# EAGLE design PS TPS54340 Voltage CurrentRev2_1 (EAGLE 9.2.2)
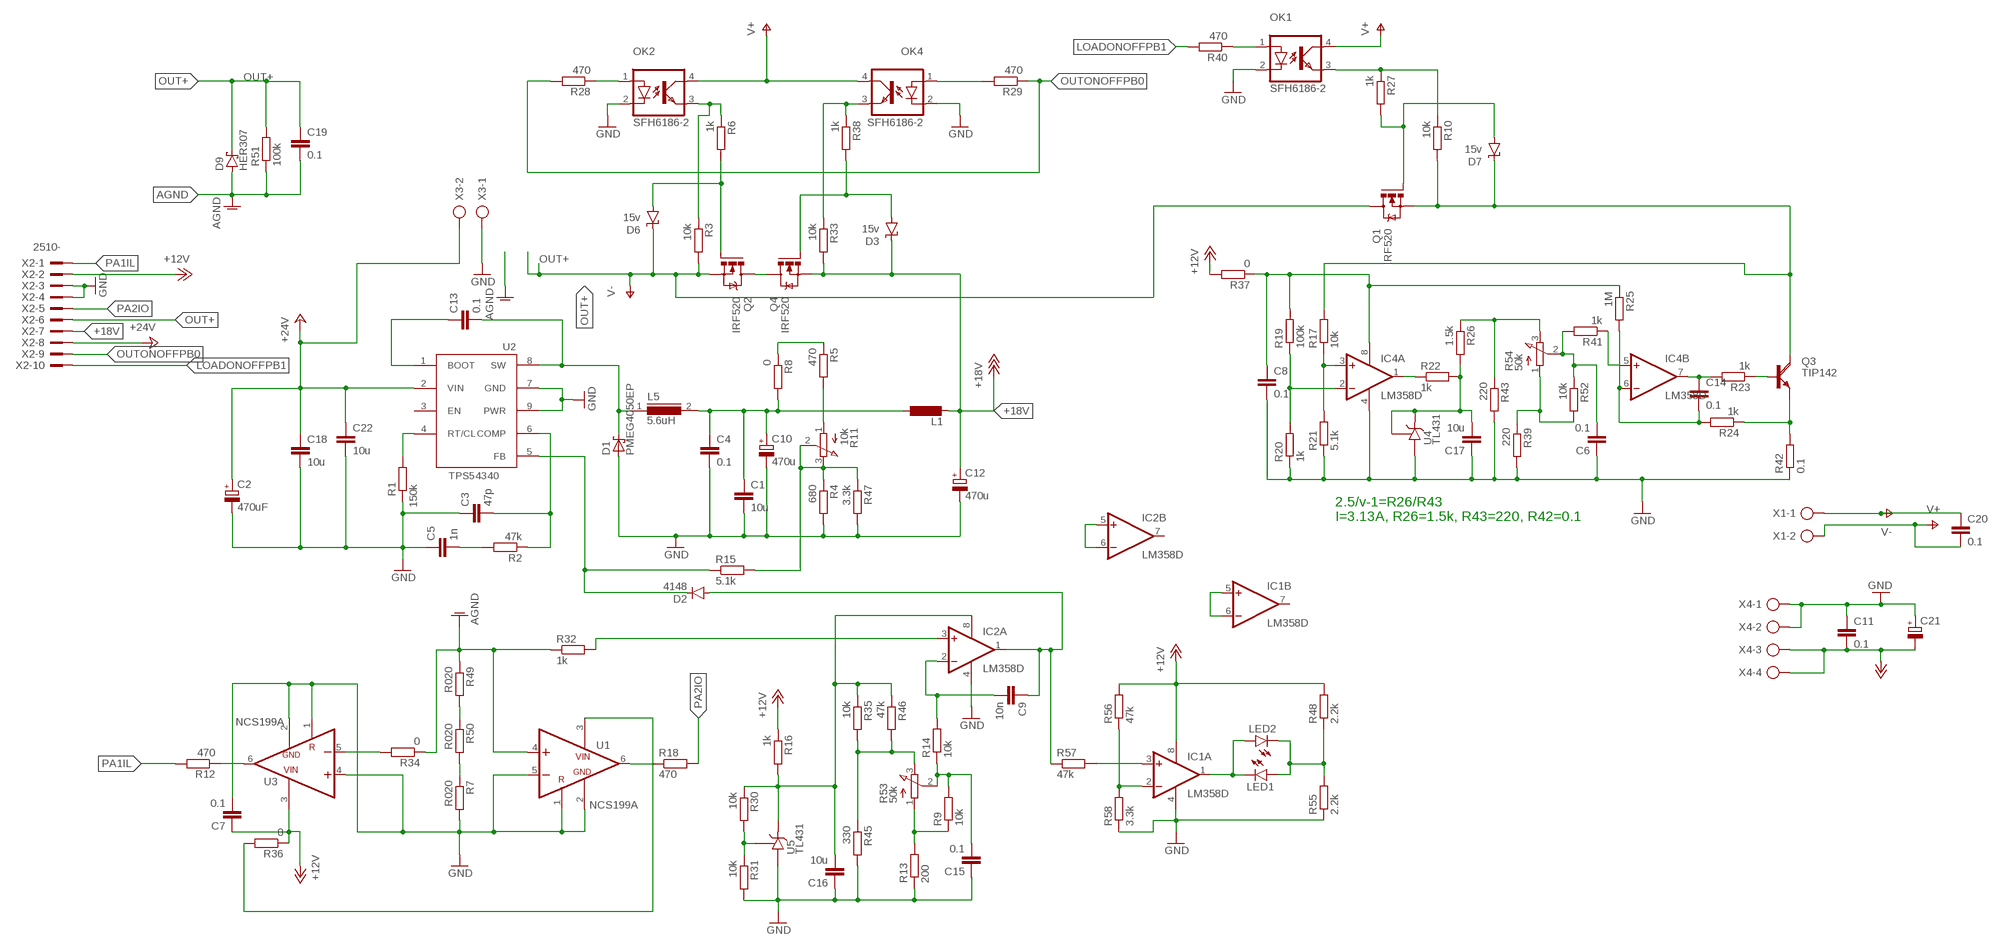
[diagram p0: schematic, sheet 1]

## Parts
C1  10u  C-EUC1210  [C1210]
C2  470uF  CPOL-EUE5-10.5  [E5-10,5]
C3  47p  C-EUC0603K  [C0603K]
C4  0.1  C-EUC1206  [C1206]
C5  1n  C-EUC0603K  [C0603K]
C6  0.1  C-EUC0603K  [C0603K]
C7  0.1  C-EUC0603K  [C0603K]
C8  0.1  C-EUC1206  [C1206]
C9  10n  C-EUC0603K  [C0603K]
C10  470u  CPOL-EUE5-10.5  [E5-10,5]
C11  0.1  C-EUC1206  [C1206]
C12  470u  CPOL-EUE5-10.5  [E5-10,5]
C13  0.1  C-EU102-043X133  [C102-043X133]
C14  0.1  C-EUC1206  [C1206]
C15  0.1  C-EUC0603K  [C0603K]
C16  10u  C-EUC0603K  [C0603K]
C17  10u  C-EUC0603K  [C0603K]
C18  10u  C-EUC1210  [C1210]
C19  0.1  C-EU150-054X183  [C150-054X183]
C20  0.1  C-EUC1206  [C1206]
C21  CPOL-EUE2.5-6  [E2,5-6]
C22  10u  C-EUC1210  [C1210]
D1  PMEG4050EP  [SOD128]
D2  4148  PMLL41SOD80C  [SOD80C]
D3  15v  SUPPRESSOR-SMBJ  [SMBJ]
D6  15v  SUPPRESSOR-SMBJ  [SMBJ]
D7  15v  SUPPRESSOR-SMBJ  [SMBJ]
D9  HER307  15KEXX  [CB429-17]
IC1  LM358D  [SO08]
IC2  LM358D  [SO08]
IC4  LM358D  [SO08]
L1  L-EU0207/5V  [0207/5V]
L5  5.6uH  DR125  [DR125]
LED1  LEDB152  [Q62902-B152]
LED2  LEDB152  [Q62902-B152]
OK1  SFH6186-2  [SMD4-7]
OK2  SFH6186-2  [SMD4-7]
OK4  SFH6186-2  [SMD4-7]
Q1  IRF520  [TO220BV]
Q2  IRF520  [TO220BV]
Q3  TIP142  [SOT93]
Q4  IRF520  [TO220BV]
R1  150k  R-EU_R1206  [R1206]
R2  47k  R-EU_R0603  [R0603]
R3  10k  R-EU_R0603  [R0603]
R4  680  R-EU_R1206  [R1206]
R5  470  R-EU_R1206  [R1206]
R6  1k  R-EU_R0603  [R0603]
R7  R020  R-EU_R1206  [R1206]
R8  0  R-EU_R0603  [R0603]
R9  10k  R-EU_R0603  [R0603]
R10  10k  R-EU_R0603  [R0603]
R11  10k  3RP/1610N  [3RP/1610N]
R12  470  R-EU_R0603  [R0603]
R13  200  R-EU_R0603  [R0603]
R14  10k  R-EU_R1206  [R1206]
R15  5.1k  R-EU_R0603  [R0603]
R16  1k  R-EU_R0603  [R0603]
R17  10k  R-EU_R1206  [R1206]
R18  470  R-EU_R0603  [R0603]
R19  100k  R-EU_R1206  [R1206]
R20  1k  R-EU_R1206  [R1206]
R21  5.1k  R-EU_R1206  [R1206]
R22  1k  R-EU_R0603  [R0603]
R23  1k  R-EU_R1206  [R1206]
R24  1k  R-EU_R1206  [R1206]
R25  1M  R-EU_R1206  [R1206]
R26  1.5k  R-EU_R0603  [R0603]
R27  1k  R-EU_R0603  [R0603]
R28  470  R-EU_R0603  [R0603]
R29  470  R-EU_R0603  [R0603]
R30  10k  R-EU_R0603  [R0603]
R31  10k  R-EU_R0603  [R0603]
R32  1k  R-EU_R1206  [R1206]
R33  10k  R-EU_R0603  [R0603]
R34  0  R-EU_R1206  [R1206]
R35  10k  R-EU_R0603  [R0603]
R36  0  R-EU_R1206  [R1206]
R37  0  R-EU_R1206  [R1206]
R38  1k  R-EU_R0603  [R0603]
R39  220  R-EU_R0603  [R0603]
R40  470  R-EU_R0603  [R0603]
R41  1k  R-EU_R1206  [R1206]
R42  0.1  R-EU_0414/15  [0414/15]
R43  220  R-EU_R0603  [R0603]
R45  330  R-EU_R0603  [R0603]
R46  47k  R-EU_R0603  [R0603]
R47  3.3k  R-EU_R1206  [R1206]
R48  2.2k  R-EU_R0603  [R0603]
R49  R020  R-EU_R1206  [R1206]
R50  R020  R-EU_R1206  [R1206]
R51  100k  R-EU_0207/15  [0207/15]
R52  10k  R-EU_R0603  [R0603]
R53  50k  3RP/1610N  [3RP/1610N]
R54  50k  3RP/1610N  [3RP/1610N]
R55  2.2k  R-EU_R0603  [R0603]
R56  47k  R-EU_R0603  [R0603]
R57  47k  R-EU_R0603  [R0603]
R58  3.3k  R-EU_R0603  [R0603]
U1  NCS199A  [SOT363]
U2  TPS54340  TPS54340SO8  [HSOP]
U3  NCS199A  [SOT363]
U4  TL431  [SOT23]
U5  TL431  [SOT23]
X1  AK500/2  [AK500/2]
X2  2510-  [PAK100/2500-10]
X3  AK500/2  [AK500/2]
X4  AK500/4  [AK500/4]

## Nets
+12V: C7.1 C11.2 C21.- IC1.8(P:V+) R16.1 R36.1 R37.2 R48.2 R56.2 U3.3(VCC) X2.2 X4.3 X4.4
+18V: C12.+ D3.C L1.2 Q4.S R33.2 X2.7
+24V: C2.+ C18.1 C22.1 U2.2(VIN) X2.8 X3.2
AGND: C19.2 D9.A R32.1 R34.1 R49.1 R51.1 U1.4(IN+)
GND: C1.2 C2.- C3.1 C4.2 C5.1 C6.1 C7.2 C8.2 C10.- C11.1 C12.- C15.1 C16.1 C17.1 C18.2 C21.+ C22.2 D1.2(A) IC1.4(P:V-) IC2.4(P:V-) IC4.4(P:V-) OK1.2(C) OK2.2(C) OK4.2(C) R1.1 R4.2 R7.2 R13.1 R20.1 R21.1 R31.2 R39.2 R42.1 R43.2 R45.2 R47.2 R55.1 R58.1 U1.1(REF) U1.2(GND) U1.5(IN-) U2.7(GND) U2.9(PWR) U3.1(REF) U3.2(GND) U3.4(IN+) U4.3(A) U5.3(A) X2.3 X2.4 X3.1 X4.1 X4.2
LOADONOFFPB1: R40.2 X2.10
N$1: R1.2 U2.4(RT/CL)
N$2: C5.2 R2.2
N$3: C3.2 R2.1 U2.6(COMP)
N$4: R5.2 R11.1(A)
N$5: D6.A Q2.G R6.2
N$6: IC2.3(A:+IN) R32.2
N$7: R4.1 R11.2(S) R11.3(E) R15.2 R47.1
N$8: C16.2 IC2.8(P:V+) R16.2 R30.1 R35.1 R46.1 U5.1(C)
N$10: OK2.3(EMIT) R3.1 R6.1
N$12: D3.A Q4.G R38.2
N$13: C13.1 U2.1(BOOT)
N$14: C13.2 D1.1(K) L5.1 U2.8(SW)
N$15: R12.1 U3.6(OUT)
N$16: C9.2 IC2.2(A:-IN) R14.2
N$17: R30.2 R31.1 U5.2(R)
N$18: C9.1 D2.A IC2.1(A:OUT) R57.1
N$19: C15.2 R9.2 R14.1 R53.2(S)
N$20: R34.2 U3.5(IN-)
N$21: D2.C R15.1 U2.5(FB)
N$22: R18.1 U1.6(OUT)
N$23: Q2.D Q4.D
N$24: IC1.1(A:OUT) LED1.K(C) LED2.A
N$25: C1.1 C4.1 C10.+ L1.1 L5.2 R8.2
N$26: Q3.B R23.1
N$27: OK1.1(A) R40.1
N$28: C14.2 IC4.6(B:-IN) R24.2 R25.2
N$30: R26.1 R43.1 R54.3(E)
N$31: D7.C Q1.S Q3.C R10.2 R17.2
N$32: OK1.3(EMIT) R10.1 R27.1
N$34: LED1.A LED2.K(C) R48.1 R55.2
N$35: R35.2 R45.1 R46.2 R53.3(E)
N$36: IC4.5(B:+IN) R41.1
N$37: IC1.2(A:-IN) R56.1 R58.2
N$38: R36.2 U1.3(VCC)
N$41: D7.A Q1.G R27.2
N$42: R39.1 R52.2 R54.1(A)
N$43: C8.1 IC4.8(P:V+) R19.2 R25.1 R37.1
N$45: R9.1 R13.2 R53.1(A)
N$46: R49.2 R50.1
N$47: IC2.5(B:+IN) IC2.6(B:-IN)
N$48: IC1.3(A:+IN) R57.2
N$49: IC1.5(B:+IN) IC1.6(B:-IN)
N$52: R7.1 R50.2
N$61: OK4.3(EMIT) R33.1 R38.1
N$62: OK4.1(A) R29.2
N$64: OK2.1(A) R28.1
N$65: C17.2 R22.2 R26.2 U4.1(C) U4.2(R)
N$66: R5.1 R8.1
N$106: Q3.E R24.1 R42.2
N$289: C14.1 IC4.7(B:OUT) R23.2
N$290: C6.2 R41.2 R52.1 R54.2(S)
N$291: IC4.1(A:OUT) R22.1
N$292: IC4.3(A:+IN) R17.1 R21.2
N$294: IC4.2(A:-IN) R19.1 R20.2
OUT+: C19.1 C20.1 D6.C D9.C Q1.D Q2.S R3.2 R51.2 X1.1 X2.6 ; supply symbol labelled V-
OUTONOFFPB0: R28.2 R29.1 X2.9
PA1IL: R12.2 X2.1
PA2IO: R18.2 X2.5
V+: C20.2 OK1.4(COL) OK2.4(COL) OK4.4(COL) X1.2
Unconnected: IC1.7(B:OUT) IC2.7(B:OUT) U2.3(EN)

## Notes on the sheet
- 2.5/v-1=R26/R43
  I=3.13A, R26=1.5k, R43=220, R42=0.1

## Library data of the parts
C1 C3 C5-C7 C9 C13 C15-C19 C22 = rcl:C-EU: CAPACITOR, European symbol; SPICEPREFIX: C
C2 C10 C12 C21 = rcl:CPOL-EU: POLARIZED CAPACITOR, European symbol; SPICEPREFIX: C
C4 C8 C11 C14 C20 = rcl:C-EU: CAPACITOR, European symbol
D1 = NXP_60_26022015:PMEG4050E: 40 V, 5 A low VF MEGA Schottky barrier rectifier Planar Maximum Efficiency General Application (MEGA) Schottky barrier rectifier with an integrated guard ring for stress protection. AAL Eindhoven MK
D2 = diode:PMLL41*: High-speed diodes Source: http://www.semiconductors.philips.com/acrobat_download/datasheets/PMLL4150_2.pdf
D3 D6 D7 = diode:SUPPRESSOR-: Suppressor diode
D9 = diode:15KEXX: DIODE
IC1 IC2 IC4 = linear:LM358: OP AMP also LM158; LM258; LM2904 Source: http://cache.national.com/ds/LM/LM158.pdf
L1 = rcl:L-EU: INDUCTOR, European symbol; SPICEPREFIX: L
L5 = inductors:DR125: High Power Density, High Efficiency, Shielded Inductors Source: coiltronics_dr_series.pdf; SPICEPREFIX: L
LED1 LED2 = led:LED: LED OSRAM: - CHIPLED LG R971, LG N971, LY N971, LG Q971, LY Q971, LO R971, LY R971 LH N974, LH R974 LS Q976, LO Q976, LY Q976 LO Q996 - Hyper CHIPLED LW Q18S LB Q993, LB Q99A, LB R99A - SideLED LS A670, LO A670, LY A670, LG A670, LP A670 LB A673, LV A673, LT A673, LW A673 LH A674 LY A675 LS A676, LA A676, LO A676, LY A676, LW A676 LS A679, LY A679, LG A679 - Hyper Micro SIDELED® LS Y876, LA Y876, LO Y876, LY Y876 LT Y87S - SmartLED LW L88C, LW L88S LB L89C, LB L89S, LG L890 LS L89K, LO L89K, LY L89K LS L896, LA L896, LO L896, LY L896 - TOPLED LS T670, LO T670, LY T670, LG T670, LP T670 LSG T670, LSP T670, LSY T670, LOP T670, LYG T670 LG T671, LOG T671, LSG T671 LB T673, LV T673, LT T673, LW T673 LH T674 LS T676, LA T676, LO T676, LY T676, LB T676, LH T676, LSB T676, LW T676 LB T67C, LV T67C, LT T67C, LS T67K, LO T67K, LY T67K, LW E67C LS E67B, LA E67B, LO E67B, LY E67B, LB E67C, LV E67C, LT E67C LW T67C LS T679, LY T679, LG T679 LS T770, LO T770, LY T770, LG T770, LP T770 LB T773, LV T773, LT T773, LW T773 LH T774 LS E675, LA E675, LY E675, LS T675 LS T776, LA T776, LO T776, LY T776, LB T776 LHGB T686 LT T68C, LB T68C - Hyper Mini TOPLED® LB M676 - Mini TOPLED Santana® LG M470 LS M47K, LO M47K, LY M47K Source: http://www.osram.convergy.de LUXEON: - LUMILED® LXK2-PW12-R00, LXK2-PW12-S00, LXK2-PW14-U00, LXK2-PW14-V00 LXK2-PM12-R00, LXK2-PM12-S00, LXK2-PM14-U00 LXK2-PE12-Q00, LXK2-PE12-R00, LXK2-PE12-S00, LXK2-PE14-T00, LXK2-PE14-U00 LXK2-PB12-K00, LXK2-PB12-L00, LXK2-PB12-M00, LXK2-PB14-N00, LXK2-PB14-P00, LXK2-PB14-Q00 LXK2-PR12-L00, LXK2-PR12-M00, LXK2-PR14-Q00, LXK2-PR14-R00 LXK2-PD12-Q00, LXK2-PD12-R00, LXK2-PD12-S00 LXK2-PH12-R00, LXK2-PH12-S00 LXK2-PL12-P00, LXK2-PL12-Q00, LXK2-PL12-R00 Source: www.luxeon.com KINGBRIGHT: KA-3528ASYC Source: www.kingbright.com
OK1 OK2 OK4 = optocoupler:SFH618?*: Optocoupler, Phototransistor Output, Low Input Current Source: Data sheet <http://www.vishay.com/docs/83673/sfh618.pdf>; MF: VISHAY/TELEFUNKEN; MPN: SFH6186-2; OC_FARNELL: 1469583; OC_NEWARK: 58K2210
Q1 Q2 Q4 = transistor-power:IRF520: HEXFET Power MOSFET
Q3 = transistor-power:TIP142: NPN DARLINGTON TRANSISTOR
R1 R4 R5 R7 R14 R17 R19-R21 R23-R25 R32 R34 R36 R37 R41 R47 R49 R50 = rcl:R-EU_: RESISTOR, European symbol
R2 R3 R6 R8-R10 R12 R13 R15 R16 R18 R22 R26-R31 R33 R35 R38-R40 R42 R43 R45 R46 R48 R51 R52 R55-R58 = rcl:R-EU_: RESISTOR, European symbol; SPICEPREFIX: R
R11 R53 R54 = pot:3RP/1610N: 16mm Potentiometer one level Source: http://www.alphapotentiometers.net/html/16mm_pot_2.html
U1 U3 = ProjectLibrary:NCS199A: NCS199A Current-Shunt Monitor, Voltage Output, Bi-Directional Zero-Drift The LNA is housed in a 6-pin SOT363 plastic SMD package.
U2 = ProjectLibrary:TPS54340: TPS54340 42 V Input, 3.5 A, Step Down DC-DC Converter with Eco-mode™
U4 U5 = 1my:TL431
X1 X3 = con-ptr500:AK500/2: CONNECTOR; OC_FARNELL: unknown; OC_NEWARK: unknown
X2 = con-3m:2510-: 3M (TM) Pak 100 4-Wall Header Source: 3M; MF: 3M; MPN: 2510-6002UB; OC_FARNELL: 9838244; OC_NEWARK: 46F4725
X4 = con-ptr500:AK500/4: CONNECTOR; OC_FARNELL: unknown; OC_NEWARK: unknown

## Board
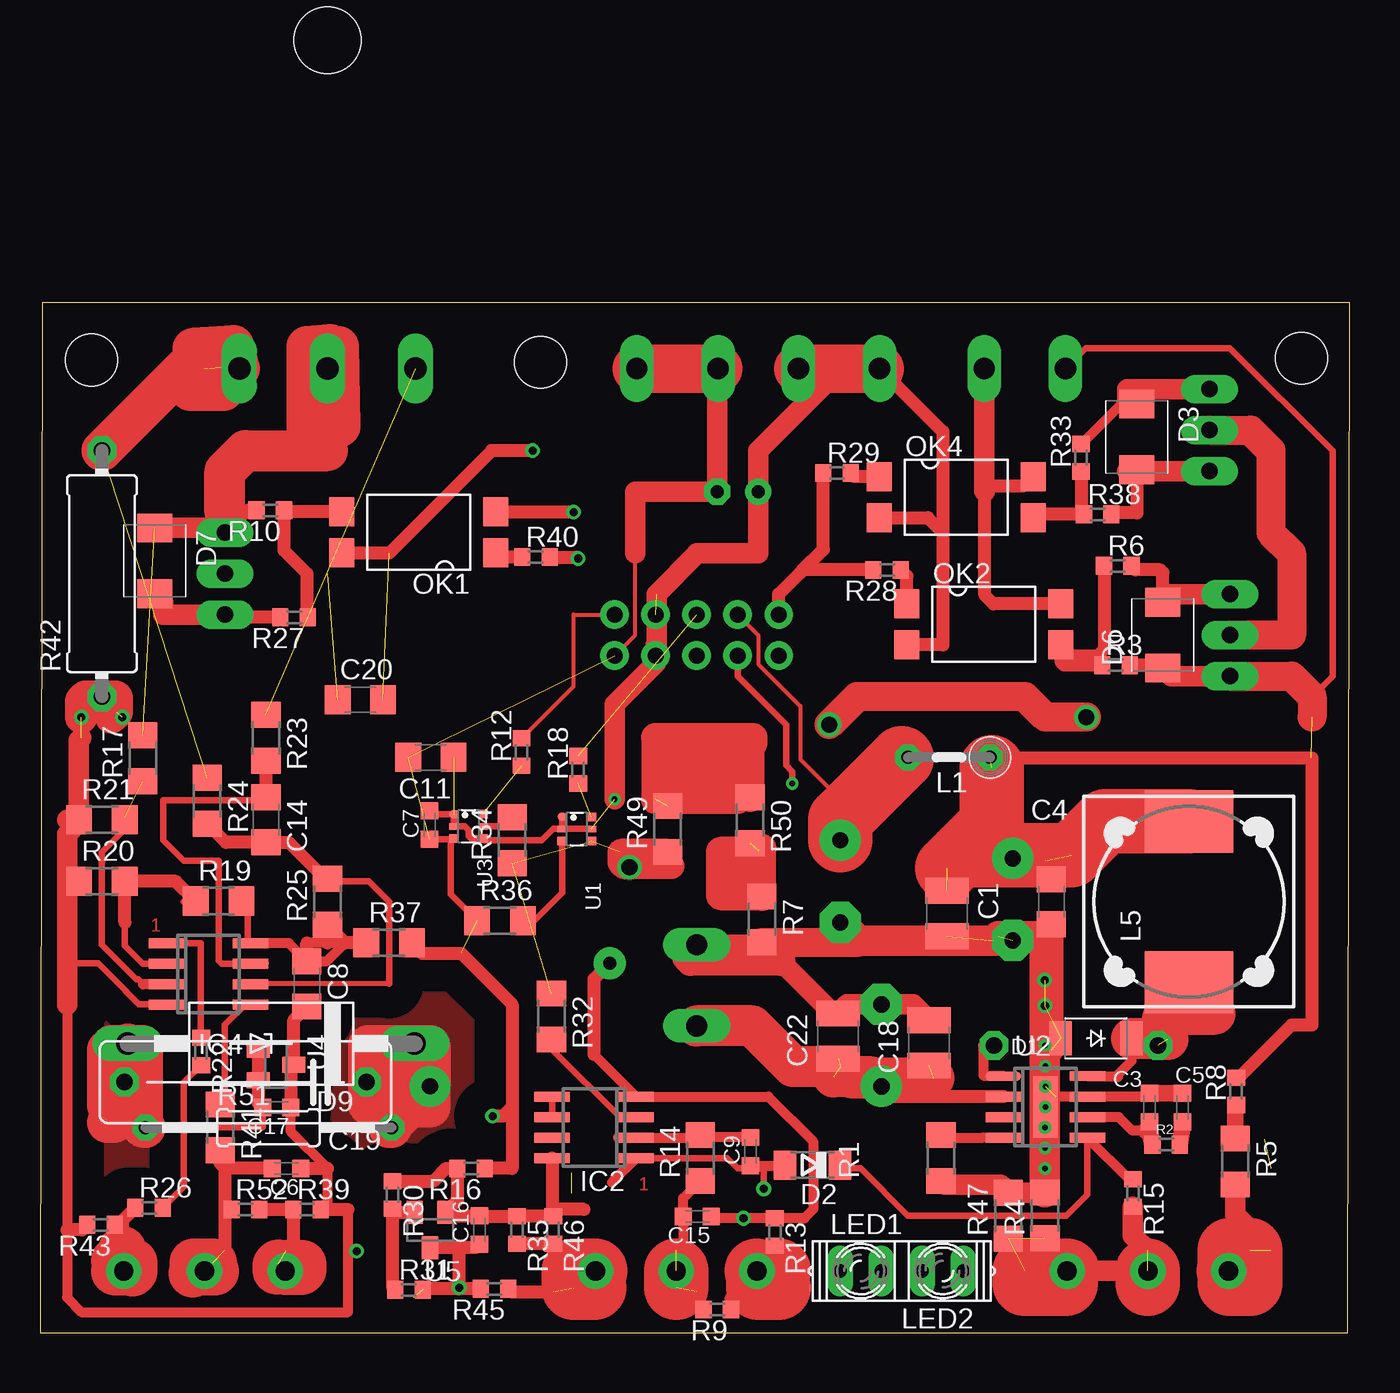
[diagram p1: board, top side]
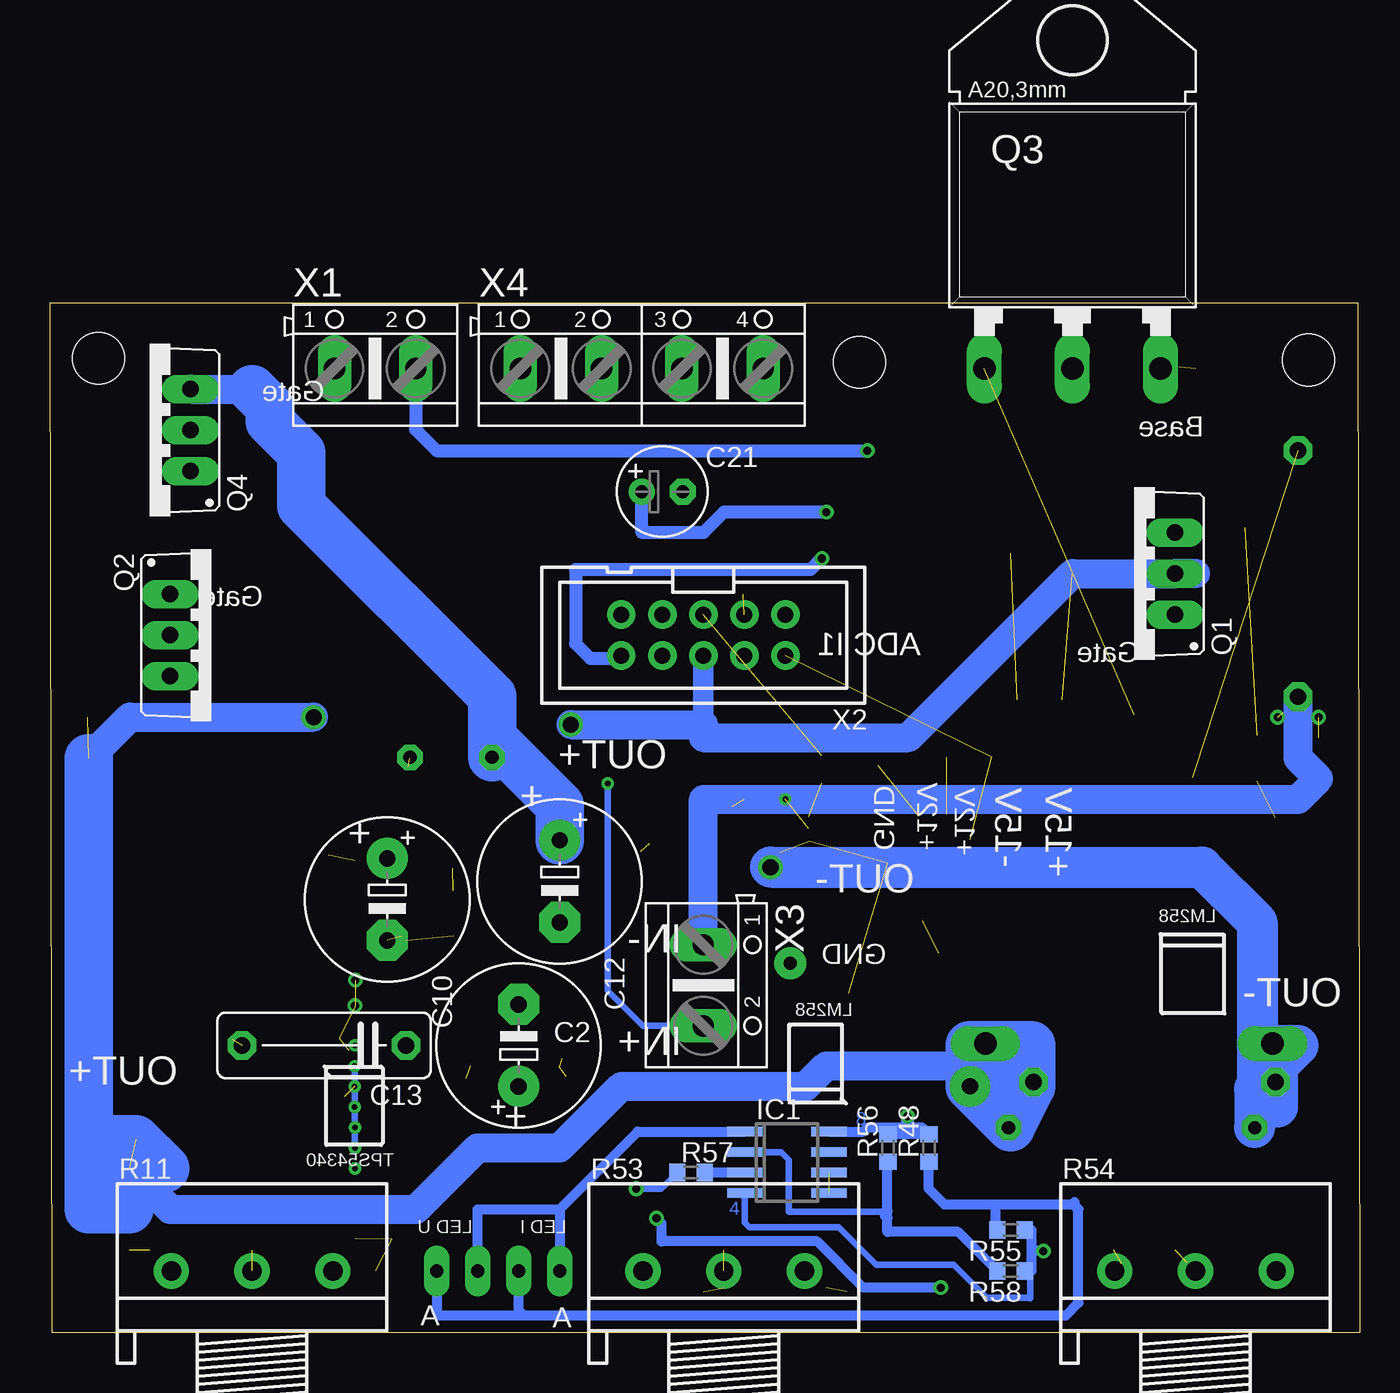
[diagram p2: board, bottom side, seen from below]

Size 81.08 x 63.76 mm. Coordinates in mm from the lower left corner, seen from the top.
Outline: 0,0 80.95,0 81.08,63.76 0.13,63.76 0,0
Copper layers (1*16): Top 0.035mm / dielectric 1.5mm / Bottom 0.035mm
Design rules "Charger for battery (TPS54340) power *": minimum track width 10mil, minimum drill 0.35mm, track to track 22mil, track to pad 10mil, pad to pad 20mil, via to via 20mil, smd to smd 6mil, copper to edge 30mil, drill to drill 6mil, minimum pad ring 15mil, minimum via ring 8mil, stop-mask expansion 4mil, vias tented up to drill 0mil, thermal gap 10mil
Holes 3.2 mm at 3.16,60.21 78.09,60.33 30.96,60.08

### Footprints (pad centres in the part's own frame; a part is rotated, then mirrored left to right if it is on the bottom)
C1210 = smd 1.6 x 2.7: 1 -1.4,0; 2 1.4,0
E5-10,5 = drill 1.016 pad 2.54: + -2.54,0 | drill 1.016 pad 2.54 octagon: - 2.54,0
C0603K = smd 1.05 x 1.08: 1 -0.875,0; 2 0.875,0
C1206 = smd 1.6 x 1.8: 1 -1.4,0; 2 1.4,0
C102-043X133 = drill 1.016 octagon: 1 -5.08,0; 2 5.08,0
C150-054X183 = drill 1.016 octagon: 1 -7.493,0; 2 7.493,0
E2,5-6 = drill 0.813 pad 1.6: + -1.27,0 | drill 0.813 pad 1.6 octagon: - 1.27,0
SOD128 = smd 1.4 x 2.1: 1 -2.2,0; 2 2.2,0
SOD80C = smd 1.4 x 1.8: A 1.7,0; C -1.7,0
SMBJ = smd 1.78 x 2.16: A 2.04,0; C -2.03,0
CB429-17 = drill 1.397 long: A 8.89,0; C -8.89,0
SO08 = smd 0.6 x 2.2: 1 -1.905,-2.6; 2 -0.635,-2.6; 3 0.635,-2.6; 4 1.905,-2.6; 5 1.905,2.6; 6 0.635,2.6; 7 -0.635,2.6; 8 -1.905,2.6
0207/5V = drill 0.813 octagon: 1 -2.54,0; 2 2.54,0
DR125 = smd 3.85 x 5.5: 1 -4.975,0; 2 4.975,0
Q62902-B152 = drill 0.813 long: A 1.27,0; K -1.27,0
SMD4-7 = smd 1.78 x 1.55: 1 -1.27,-4.77; 2 1.27,-4.77; 3 1.27,4.77; 4 -1.27,4.77
TO220BV = drill 1.016 long: D 0,-2.54; G -2.54,-2.54; S 2.54,-2.54
SOT93 = drill 1.397 long: B -5.461,-10.16; C 0,-10.16; E 5.461,-10.16 | hole 4.115: 0,10.16
R1206 = smd 1.6 x 1.803: 1 -1.422,0; 2 1.422,0
R0603 = smd 1 x 1.1: 1 -0.85,0; 2 0.85,0
3RP/1610N = drill 1.2 pad 2.184: 1 -5,0; 2 0,0; 3 5,0
0414/15 = drill 1.016 octagon: 1 -7.62,0; 2 7.62,0
0207/15 = drill 0.813 octagon: 1 -7.62,0; 2 7.62,0
SOT363 = smd 0.524 x 0.6: 1 -0.75,-0.9; 3 0.75,-0.9; 4 0.75,0.9; 6 -0.75,0.9 | smd 0.4 x 0.6: 2 0,-0.9; 5 0,0.9
HSOP = smd 0.6 x 2.2: 1 -1.905,-2.6; 2 -0.635,-2.6; 3 0.635,-2.6; 4 1.905,-2.6; 5 1.905,2.6; 6 0.635,2.6; 7 -0.635,2.6; 8 -1.905,2.6 | smd 3.81 x 1.524: 9 0,0
SOT23 = smd 1 x 1.4: 1 -0.95,-1.1; 2 0.95,-1.1; 3 0,1.1
AK500/2 = drill 1.321 long: 1 -2.515,0; 2 2.515,0
PAK100/2500-10 = drill 1 pad 1.422: 1 -5.08,-1.27; 2 -5.08,1.27; 3 -2.54,-1.27; 4 -2.54,1.27; 5 0,-1.27; 6 0,1.27; 7 2.54,-1.27; 8 2.54,1.27; 9 5.08,-1.27; 10 5.08,1.27
AK500/4 = drill 1.321 long: 1 -7.518,0; 2 -2.489,0; 3 2.489,0; 4 7.518,0

### Placement (x,y rotation side)
C1  56.13,25.95 270 top
C2  52.07,17.78 90 bottom
C3  68.67,13.93 270 top
C4  62.6,26.67 270 top
C5  70.71,13.93 270 top
C6  15.24,10.16 180 top
C7  24.1,31.42 90 top
C8  16.5,21.59 270 top
C9  43.98,11.2 90 top
C10  60.21,26.82 270 bottom
C11  24.18,35.61 180 top
C12  49.53,27.94 270 bottom
C13  64.12,17.78 180 bottom
C14  13.97,31.75 270 top
C15  40.68,7.18 180 top
C16  27.19,6.35 90 top
C17  14.63,13.93 180 top
C18  55.03,17.93 90 top
C19  12.7,15.51 180 top
C20  19.81,39.18 0 top
C21  43.18,52.07 0 bottom
C22  49.39,18.35 90 top
D1  65.37,18.21 180 top
D2  47.8,10.36 180 top
D3  67.89,55.46 270 top
D6  69.51,43.18 90 top
D7  7.07,47.79 270 top
D9  14.29,17.89 180 top
IC1  35.46,10.54 270 bottom
IC2  34.29,12.7 90 top
IC4  10.41,22.2 270 top
L1  56.26,35.61 180 top
L5  71.12,26.67 90 top
LED1  50.8,3.81 0 top
LED2  55.88,3.81 180 top
OK1  23.43,49.56 90 top
OK2  58.42,43.85 270 top
OK4  56.71,51.73 270 top
Q1  13.97,46.99 90 bottom
Q2  71.12,43.18 270 bottom
Q3  17.78,69.85 0 bottom
Q4  74.93,55.88 90 bottom
R1  55.77,10.81 90 top
R2  69.71,11.63 0 top
R3  66.6,41.33 0 top
R4  62.2,7.25 90 top
R5  73.99,10.59 270 top
R6  66.71,47.47 0 top
R7  44.68,25.58 270 top
R8  74.04,14.94 90 top
R9  41.91,1.42 180 top
R10  14.24,50.91 180 top
R11  68.58,3.81 0 bottom
R12  29.79,35.94 90 top
R13  45.48,6.22 270 top
R14  40.87,10.81 90 top
R15  67.65,8.64 270 top
R16  26.67,10.16 180 top
R17  6.35,35.56 90 top
R18  33.3,34.85 90 top
R19  11.04,26.72 0 top
R20  3.81,27.94 0 top
R21  3.81,31.75 0 top
R22  9.96,17.4 270 top
R23  13.97,36.83 270 top
R24  10.33,32.93 270 top
R25  17.78,26.67 90 top
R26  6.73,7.72 0 top
R27  15.71,44.28 180 top
R28  52.43,47.22 180 top
R29  49.33,53.23 0 top
R30  21.81,8.52 270 top
R31  22.82,2.64 0 top
R32  31.65,19.57 270 top
R33  64.44,54.17 90 top
R34  29.21,30.48 90 top
R35  29.51,6.35 270 top
R36  28.46,25.5 0 top
R37  21.59,24.13 0 top
R38  65.47,50.66 0 top
R39  16.51,7.62 0 top
R40  30.68,48.02 0 top
R41  11.14,12.7 270 top
R42  3.81,46.99 90 top
R43  3.75,6.67 180 top
R45  28.12,2.71 180 top
R46  31.75,6.35 270 top
R47  59.93,7.24 90 top
R48  26.67,11.43 90 bottom
R49  38.84,31.18 90 top
R50  43.94,31.71 270 top
R51  14.12,12.69 0 top
R52  12.7,7.62 0 top
R53  39.37,3.81 0 bottom
R54  10.16,3.81 0 bottom
R55  21.59,6.35 180 bottom
R56  29.21,11.43 90 bottom
R57  41.4,9.91 0 bottom
R58  21.59,3.81 180 bottom
U1  33.21,31.18 270 top
U2  62.23,13.97 270 top
U3  26.5,31.34 270 top
U4  14.59,16.57 270 top
U5  24.13,6.35 180 top
X1  60.96,59.69 0 bottom
X2  40.64,43.18 180 bottom
X3  40.64,21.5 270 bottom
X4  44.45,59.69 0 bottom

### Tracks (layer width: path | path; a pad name or v marks a point on that pad's centre or on a via)
+12V  (via drill 0.5)  (3 unrouted)
  Top 0.254: X2.2 36.83,43.18 36.83,48.26
  Top 0.406: R36.1 25.4,27.14 25.4,30.39 U3.3 25.56,30.55 C7.1
  Top 0.813: R37.2 23.67,23.47 26.06,23.47 29.21,20.32 29.21,13.97 | 29.21,13.97 29.21,10.16 R16.1 | 29.21,13.97 28.64,13.4 v28,13.4
  Top 1.27: X4.3 41.91,59.64 C21.- 36.83,52.07 36.83,48.26
  Top 3: X4.3 X4.4
  Bottom 0.61: R56.2 R48.2 27.09,12.7 27.94,12.7 30.48,12.7 30.73,12.45 IC1.8
  Bottom 0.813: v28,13.4 28,12.76 27.94,12.7
+18V
  Top 0.254: X2.7 44.46,43.17 44.46,41.39 47.07,38.78 47.07,35.48 49.53,33.02 C12.+
  Top 0.61: R33.2 66.92,57.49 67.31,57.49 D3.C
  Top 1.27: Q4.S 67.31,58.42 67.31,57.49
  Top 4: C12.+ 49.53,31.75 53.34,35.56
  Bottom 1.8: Q4.S 68.58,58.42
  Bottom 3: 68.58,58.42 67.49,57.33 67.49,56.44 65.52,54.47 65.52,51.19 53.72,39.4 53.72,36.83 | 53.72,36.83 L1.2 | 53.72,36.83 49.53,32.64 C12.+
+24V  (via drill 0.35)  (3 unrouted)
  Top 0.406: X2.8 43.18,40.64 46.18,37.64 46.18,35.12 46.56,34.73 v46.56,34
  Top 0.813: U2.2 52.7,14.61 C2.+
  Top 2.54: C2.+ 51.47,15.84 49.12,15.84 | 55.32,15.75 50.29,15.75 49.57,16.47 46.61,16.47 44.09,18.99 X3.2
  Bottom 0.406: v46.56,34 46.56,21.16 44.39,18.99 X3.2
AGND  (via drill 1)  (3 unrouted)
  Top 1.6: R49.1 35.94,29.76 35.92,29.73 35.92,29.1 36.13,28.88 36.54,28.88 | 39.08,28.88 36.54,28.88 | 36.54,28.88 v36.47,28.82
  Top 2.5: 5.08,17.78 5.28,17.78 D9.A 5.21,17.7 C19.2 | R51.1 6.35,12.7 6.35,17.78 4.42,17.78 4.15,17.51 4.15,14.05 4.88,13.32 4.53,12.98 4.15,12.98
  Bottom 2.54: v36.47,28.82 9.77,28.82 6.35,25.4 6.35,15.24 5.08,13.97 5.08,17.78 3.81,17.78 6.5,15.09 R51.1
  pour Top (isolate 1.93, no thermals): 2.54,21.59 6.35,21.59 8.89,19.05 8.89,10.16 6.35,7.62 2.54,7.62
GND  (via drill 0.35, 0.5, 0.5 pad 0.7, 0.5 pad 2, 0.8 pad 2)  (12 unrouted)
  Top 0.406: U1.5 U1.2 | U1.1 U1.2 | U1.2 31.75,31.18 31.05,30.48 27.52,30.48 U3.4 26.64,30.59 26.52,30.72 26.52,31.09 26.26,31.34 U3.2 U3.1 24.31,32.09 C7.2 | 2.54,27.79 R20.1 1.65,28.68 1.65,30.48 | IC4.4 7.79,20.32 6.09,20.32 5.28,21.12 5.28,21.17 3.6,22.86 1.65,22.86 | 62.2,16.51 v62.23,16.48 | U2.9 62.23,12.72 v62.2,12.7 | 62.6,17.48 62.29,17.78 v62.2,17.78
  Top 0.61: C3.1 68.22,14.61 U2.7 62.87,14.61 U2.9 | 1.65,20.3 1.65,6.35 1.65,2.16 2.54,1.27 19.05,1.27 19.05,5.08 | 19.05,5.08 19.05,7.62 | 17.78,7.62 17.78,10.16 15.51,12.44 C17.1 | C8.2 16.03,19.72 16.03,19.7 | 34.29,17.2 IC2.4 45.09,14.61 47.85,11.84 47.85,7.62 47.31,7.07 R13.1 v43.53,7.07 | v43.53,7.07 41.66,7.07 C15.1 | v43.54,7.08 v43.53,7.07 | v19.58,5.04 19.09,5.04 19.05,5.08
  Top 0.813: C5.1 70.65,14.87 68.85,14.87 | 27.27,5.4 C16.1 26.97,5.25 25.93,5.25 | R45.2 25.93,2.71 | 25.93,2.71 23.73,2.71 R31.2 | 34.29,17.2 34.29,21.89 v35.26,22.86 | R43.2 2.58,6.35 1.65,6.35 | C17.1 15.51,16.39 U4.3 15.69,19.36 16.03,19.7 | R39.2 17.78,7.62 19.05,7.62 | C6.1 17.78,10.16 | 25.93,5.25 U5.3 | 25.93,5.25 v25.93,2.78 25.93,2.71 | OK4.2 54.95,50.46 55.88,49.53 | 55.88,49.53 55.88,42.58 OK2.2 | X4.1 55.88,55.78 55.88,49.53 | OK1.2 32.99,50.83 v33.02,50.8
  Top 1.016: C3.1 C5.1 70.73,14.81
  Top 1.27: R21.1 2.39,31.6 1.65,30.86 1.65,30.48 1.65,22.86 1.65,20.3 | R21.1 1.65,31.75 | R1.1 56.01,9.14 59.45,9.14 R47.2 R4.2 | R21.1 2.39,36.68 2.54,36.83 | X3.1 44.54,24.02 R7.2 45.85,22.99 49.08,19.75 C22.2 49.96,20.32 C2.- 54.04,20.32 C18.2 | 49.53,59.69 44.45,54.61 C21.+ 44.45,48.26 40.64,48.26 40.64,48.21 38.15,45.72 38.15,42.63 38.1,42.58 X2.4 38.1,41.43 35.56,38.89 v35.56,33.02
  Top 1.5: C4.2 62.6,17.48
  Top 1.8: 45.85,22.99 40.26,22.99 40.01,23.24 40.64,23.88 X3.1 | R7.2 50.57,24.16 50.67,24.26
  Top 1.9: R4.2 v62.2,10.16 v62.2,11.43 v62.2,12.7 62.2,16.51 v62.2,17.78 62.2,24.38 62.06,24.52 59.32,24.52 59.05,24.26 50.67,24.26 C12.-
  Top 2: v2.54,38.1 2.54,39.12 2.79,39.37 R42.1 4.67,39.37 4.72,39.32 4.72,38.42 4.39,38.09
  Top 3: X4.2 49.53,59.69 X4.1
  Bottom 0.406: IC1.4 38.06,6.79 37.8,6.53 32.24,6.53 29.92,4.2 25.15,4.2 23.1,2.16 20.46,2.16 20.43,2.13 20.41,2.13 20.41,3.48 R58.1 | v62.23,16.48 U2.9 62.23,11.46 v62.2,11.43 | v62.2,10.16 62.23,10.16
  Bottom 0.61: v25.93,2.78 30.72,2.78 33.59,5.65 43.22,5.65 43.22,6.76 v43.54,7.08 | R55.1 20.32,6.35 20.32,5.08 | 20.32,5.08 20.32,3.81 R58.1 | 20.32,5.08 19.62,5.08 v19.58,5.04
  Bottom 0.813: v33.02,50.8 39.37,50.8 40.64,49.53 44.45,49.53 C21.+
  Bottom 1.8: X3.1 40.64,33.02 v35.56,33.02 3.81,33.02 2.54,34.29 3.81,35.56 R42.1
  other vias: 62.2,20.24 62.18,21.82 5.08,38.1 62.23,15.24 62.23,13.97
LOADONOFFPB1  (via drill 0.5)
  Top 0.813: R40.2 33.21,48.02 v33.3,47.93
  Bottom 0.813: v33.3,47.93 34,47.23 48.55,47.23 48.55,42.66 47.64,41.74 45.88,41.74 X2.10
N$1
  Top 0.61: U2.4 58.28,12.05 55.95,12.05 R1.2
N$2
  Top 1.016: C5.2 70.7,12.62 R2.2
N$3
  Top 0.61: U2.6 66.78,13.34 67.61,12.5 68.45,12.5 C3.2
  Top 1.016: R2.1 68.67,12.64 68.52,12.52 68.45,12.5
N$4  (1 unrouted)
  Top 1.27: R5.2 73.99,7.29 76.2,5.08
  Top 4: R11.1 73.66,3.89 73.66,5.08 74.93,5.08 74.93,3.02 73.66,3.02
N$5
  Top 0.813: D6.A 69.51,47.07 69.36,47.22 67.82,47.22 R6.2
  Top 1.27: D6.A 70.01,45.72 Q2.G
N$6
  Top 0.406: R32.2 31.65,17.58 35.9,13.34 IC2.3
N$7  (3 unrouted)
  Top 1.27: R15.2 67.65,6.01 68.58,5.08 | 63.5,3.02 64.29,3.81 R11.2
  Top 4: R11.3 60.96,3.81 60.96,3.02 63.5,3.02 | R11.2 68.58,3.02
N$8
  Top 0.813: IC2.8 31.69,7.62 | 31.69,7.62 31.69,7.26 R46.1 R35.1 27.22,7.2 C16.2 25.3,7.22 U5.1 25.82,8.19 R16.2 25.13,10.16 24.35,9.37 R30.1 | 33.67,7.62 31.69,7.62
N$10
  Top 0.813: R3.1 63.37,41.33 63.22,41.48 63.22,41.88 63.89,41.88 | 63.89,41.88 OK2.3 | R6.1 65.86,42.3 65.44,41.88 63.89,41.88
N$12
  Top 0.813: D3.A 67.89,50.75 66.41,50.75 R38.2
  Top 1.27: Q4.G 67.31,53.34 67.39,53.42 D3.A
N$13
  Top 0.61: U2.1 58.45,15.88 58.41,15.91 58.41,17.73 58.37,17.77 58.38,17.78 C13.1
N$14  (1 unrouted)
  Top 0.61: U2.8 66.7,15.88 66.74,15.84 66.74,15.99 67.57,16.82 D1.1
  Top 2.54: D1.1 69.75,18.21 69.81,18.15 69.81,19.13 69.48,19.46 69.75,19.72 | 69.75,19.72 72.75,19.72 | L5.1 71.12,21.09 69.75,19.72
N$15  (1 unrouted)
N$16
  Top 0.61: 43.79,11.89 C9.2 40.72,12.08 | 35.75,12.06 IC2.2 40.56,12.06 40.58,12.08 40.72,12.08 | 40.72,12.08 R14.2
N$17
  Top 0.813: U5.2 22.03,7.45 R30.2 21.81,2.81 R31.1
N$18  (via drill 0.5)
  Top 0.406: IC2.1 42.55,10.79 43.18,10.16 43.81,10.16 C9.1 | 44.45,10.33 44.79,9.98 v44.79,8.9
  Top 0.61: C9.1 44.45,10.33 46.07,10.33 D2.A | IC2.1 35.39,9.3
  Bottom 0.406: v44.79,8.9 43.26,8.9 R57.1
N$19  (2 unrouted)
  Top 0.61: R14.1 39.8,8.32 C15.2 39.8,5.51 39.37,5.08
  Top 0.813: R9.2 40.64,1.84 40.64,2.54
  Top 4: R53.2 39.37,2.76
N$20
  Top 0.406: U3.5 28.8,31.34 29.21,31.75 R34.2
N$21
  Top 0.406: U2.5 64.83,8.53 63.54,7.24 53.72,7.24 50.8,10.16 49.71,10.16 D2.C
  Top 0.61: U2.5 67.41,9.49 R15.1
N$22  (1 unrouted)
N$23
  Top 1.8: Q4.D 74.93,55.88 76.2,54.61 76.2,49.53 77.47,48.26 77.47,43.18 Q2.D
N$24
  Bottom 0.61: LED2.A 54.61,7.62 49.53,7.62 | 49.53,7.62 LED1.K | 49.53,7.62 44.7,12.45 IC1.1
N$25  (3 unrouted)
  Top 0.813: R8.2 74.2,15.79 77.47,19.05 78.74,19.05 78.74,35.56 58.8,35.56 L1.1
  Top 1.27: C4.1 62.23,28.44 62.23,29.21 62.08,29.36 C10.+
  Top 4: L5.2 65.94,31.64 63.83,29.54 56.95,29.54 | 56.95,29.54 56.16,28.75 | 56.95,29.54 58.9,31.5 58.9,35.01
N$26  (1 unrouted)
N$27
  Top 0.813: R40.1 28.47,48.02 OK1.1
N$28
  Top 0.305: 21.59,21.59 13.04,21.59 IC4.6
  Top 0.406: IC4.6 12.99,21.59 | R25.2 17.93,27.94 20.32,27.94 21.59,26.67 21.59,21.59
  Top 0.813: R24.2 11.48,30.35 C14.2 15.37,30.35 17.78,27.94 R25.2
N$30
  Top 0.813: R43.1 5.08,6.18 | 5.08,6.18 5.08,4.88 | R26.1 5.08,6.92 5.08,6.18
  Top 3: R54.3 4.65,3.81 4.64,3.8 5.61,3.8 5.69,3.72 5.77,3.8 5.77,4.3 4.76,4.3 4.64,4.43 5.08,4.88 5.08,5.08
N$31  (1 unrouted)
  Top 0.813: R10.2 12.81,50.91 Q1.S
  Top 1.27: D7.C 11.14,49.82 Q1.S 11.43,50.8
  Top 2.54: 16.51,55.88 Q3.C 17.78,59.18 18.45,61.06 18.54,56.11 16.51,55.88 | 16.51,55.88 16.52,61.06 17.93,61.19 | 11.43,50.8 11.43,53.34 12.7,54.61 17.78,54.61 16.51,55.88
N$32
  Top 0.813: OK1.3 15.18,50.83 R10.1 15.09,48.41 16.51,46.99 16.51,44.34 R27.1
N$34
  Bottom 0.61: LED2.K 57.15,1.27 56.95,1.07 51.77,1.07 | 51.77,1.07 52.07,1.37 LED1.A | 22.57,7.91 17.8,7.91 17.64,8.08 17.64,7.87 17.41,7.64 17.41,1.83 18.17,1.07 51.77,1.07 | 22.57,7.91 22.57,6.48 R55.2 | 22.57,7.91 25.69,7.91 26.67,8.89 R48.1
N$35  (1 unrouted)
  Top 0.813: R35.2 R46.2 31.75,2.54 29.13,2.54 R45.1
  Top 4: R53.3 33.02,3.81 33.02,2.76 34.29,2.76
N$36
  Top 0.406: R41.1 11.43,14.41 11.43,19.05 12.68,20.3 IC4.5
N$37
  Bottom 0.406: IC1.2 35.83,11.18 35.34,10.69 35.34,7.49 29.29,7.49 29.25,7.53
  Bottom 0.61: R58.2 24.87,6.24 29.25,6.24 29.25,7.1 | 29.25,7.1 29.25,7.53 29.25,10.54 R56.1 | 29.38,7.23 29.25,7.1
N$38
  Top 0.406: U1.3 32.31,27.23 30.58,25.5 R36.2
N$41
  Top 0.813: R27.2 11.6,44.28 Q1.G
  Top 1.27: D7.A 7.62,45.2 7.62,44.45 Q1.G
N$42  (1 unrouted)
  Top 0.813: R52.2 R39.1 15.66,5.5 15.24,5.08
  Top 2.54: R54.1 15.24,3.81
  Top 3: R54.1 16.14,3.81 16.22,3.89 16.22,4.22 14.77,4.22 14.72,4.27 14.63,4.18 14.63,3.85
N$43
  Top 0.406: 13.36,24.11 IC4.8 12.84,24.27 12.84,26.34 R19.2
  Top 0.61: IC4.8 15.38,24.11 C8.1 17.73,22.99 18.87,24.13 17.77,24.13 16.51,24.13 16.5,24.13
  Top 0.813: C8.1 16.5,24.13 | 17.77,24.13 17.77,25.23 18.87,24.13 R37.1
  Top 1.27: R25.1 17.77,25.23
N$45
  Top 0.813: R13.2 44.18,4.08 44.37,3.89 R53.1 44.37,3.73 42.76,2.12 R9.1
  Top 4: R53.1 44.45,3.73 | 44.45,3.73 44.45,2.76 45.72,2.76 | 44.45,3.73 45.64,3.73 45.72,3.81
N$46  (1 unrouted)
  Top 1.8: R50.1 43.94,36.32 44.13,36.51 44.13,36.83 38.1,36.83 38.1,33.02 43.18,33.02 43.18,35.56 39.37,35.56 39.37,34.29 41.91,34.29
N$47
  Top 0.406: IC2.5 IC2.6
N$48
  Bottom 0.61: IC1.3 R57.2
N$49  (1 unrouted)
N$52  (1 unrouted)
  Top 1.8: 44.68,29.96 R7.1 44.63,27.05 42.11,27.05 42.11,29.79 43.18,29.79 | 44.68,29.96 44.69,29.97 | 44.68,29.96 44.51,29.79 43.18,29.79 | 43.18,29.79 43.4,29.58 43.4,28.04
N$61
  Top 0.813: R33.1 64.44,50.84 R38.1 61.68,50.66 OK4.3
N$62
  Top 0.813: OK4.1 50.41,53 R29.2
N$64
  Top 0.813: OK2.1 53.65,46.84 R28.1
N$65
  Top 0.406: C17.2 13.76,12.7 8.89,12.7 | 8.89,12.7 8.89,9.03 R26.2 | R22.2 8.89,15.48 8.89,12.7
  Top 0.813: U4.1 U4.2 13.49,14.2 C17.2
N$66
  Top 1.016: R8.1 73.99,14.03 R5.1
  Top 1.27: 74.04,12.06 R5.1
N$106  (2 unrouted)
  Top 2.54: Q3.E 11.96,61.11 10.07,60.98 9.46,60.94 9.28,58.34 11.34,58.34 11.16,59.78 | R42.2 8.89,59.69 10.16,59.69
N$289
  Top 0.406: 13.97,22.86 13.04,22.86 IC4.7 11.24,22.84 11.05,23.02 11.05,29.21 8.89,29.21 7.62,30.48 7.62,32.94 13.76,32.94 C14.1
  Top 0.813: R23.2 C14.1
N$290  (1 unrouted)
  Top 0.813: R52.1 11.43,7.2 | 11.43,7.2 11.43,5.08 | C6.2 11.43,10.16 11.14,10.45 R41.2 11.43,10.99 11.43,7.2
  Top 3: R54.2 10.77,3.81 10.78,3.8 9.56,3.8 9.49,3.72 | 9.45,3.68 9.49,3.72 | 9.49,3.72 9.49,4.3 10.67,4.3
N$291
  Top 0.406: IC4.1 7.83,24.09 9.92,24.09 9.92,18.29 R22.1
N$292  (1 unrouted)
  Top 0.406: IC4.3 6.86,21.57 | 5.23,31.9 R21.2 5.23,31.17 3.81,29.74 3.81,29.21 | 3.83,29.18 3.81,29.21 | 6.35,21.57 6.04,21.87 5.95,21.87 3.81,24.01 3.81,29.21
  Top 0.61: IC4.3 6.35,21.57
N$294
  Top 0.406: 7.84,22.86 IC4.2 6.35,22.84 5.23,23.95 5.23,25.4 | R19.1 8.94,26.72 8.89,26.67
  Top 0.813: R19.1 8.39,27.94 R20.2 5.23,25.4
OUT+  (via drill 1, 1 pad 2.5)  (3 unrouted)
  Top 0.406: X1.1 64.75,60.96 73.66,60.96 80.01,54.61 80.01,40.64 78.74,39.37
  Top 0.813: D6.C 69.33,41.33 R3.2
  Top 1.27: D6.C 70.02,40.64 Q2.S
  Top 1.8: Q2.S 77.47,40.64 78.74,39.37 78.74,38.1 | v64.77,38.1 62.23,38.1 60.96,39.37 50.57,39.37 v48.84,37.64
  Top 2.54: R51.2 20.32,14.11 20.32,17.78 24.13,17.78 v24.13,15.24 | v24.13,15.24 24.13,13.97 22.86,13.97 21.59,12.7 21.59,16.51 v24.13,15.24
  Bottom 1.27: X2.6 40.64,37.64 40.64,36.83
  Bottom 1.8: 76.2,10.16 73.66,7.62 58.42,7.62 54.61,11.43 49.53,11.43 45.72,15.24 34.29,15.24 33.02,16.51 22.86,16.51 21.59,15.24 | 78.69,35.56 76.15,38.1 v64.77,38.1 | v48.84,37.64 40.64,37.64 | 40.64,36.83 27.94,36.83 17.78,46.99 Q1.D 10.16,46.99
  Bottom 3: v24.13,15.24 24.13,17.78 | 24.13,17.78 20.32,17.78 20.32,15.24 21.59,12.7 v24.13,15.24 | v24.13,15.24 21.59,15.24 24.13,17.78 | 77.93,11.98 75.77,11.98 73.95,10.16 | 78.69,35.56 78.69,7.62 76.2,7.62 76.2,10.16 77.47,10.16
  pour Top (isolate 1.93, no thermals): 17.78,22.86 27.94,22.86 27.94,10.16 17.78,10.16
OUTONOFFPB0
  Top 0.813: X2.9 45.72,45.72 46.99,46.99 47.22,47.22 | R29.1 48.48,48.48 47.22,47.22 | R28.2 47.22,47.22
PA1IL
  Top 0.254: R12.2 33.02,40.02 33.02,44.45 X2.1
PA2IO  (1 unrouted)
V+  (via drill 0.5)  (1 unrouted)
  Top 0.813: OK1.4 19,48.28 19.02,48.26 21.59,48.26 27.94,54.61 v30.48,54.61 | OK2.4 59.02,45.12 58.48,45.66 58.48,52.07 58.48,52.44 60.92,52.44 OK4.4
  Top 1.27: X1.2 58.45,52.11 58.48,52.07
  Bottom 0.813: X1.2 58.45,55.91 57.15,54.61 v30.48,54.61

### Text on the board
Top: 1 | 1
Bottom: 8 | 4
bPlace: Gate | Base | Gate | Gate | ADC I1 | OUT+ | +15V | -15V | +12V | +12V | GND | + | + | OUT- | LM258 | GND | IN- | OUT- | LM258 | IN+ | OUT+ | + | TPS54340 | LED I | LED U | A | A